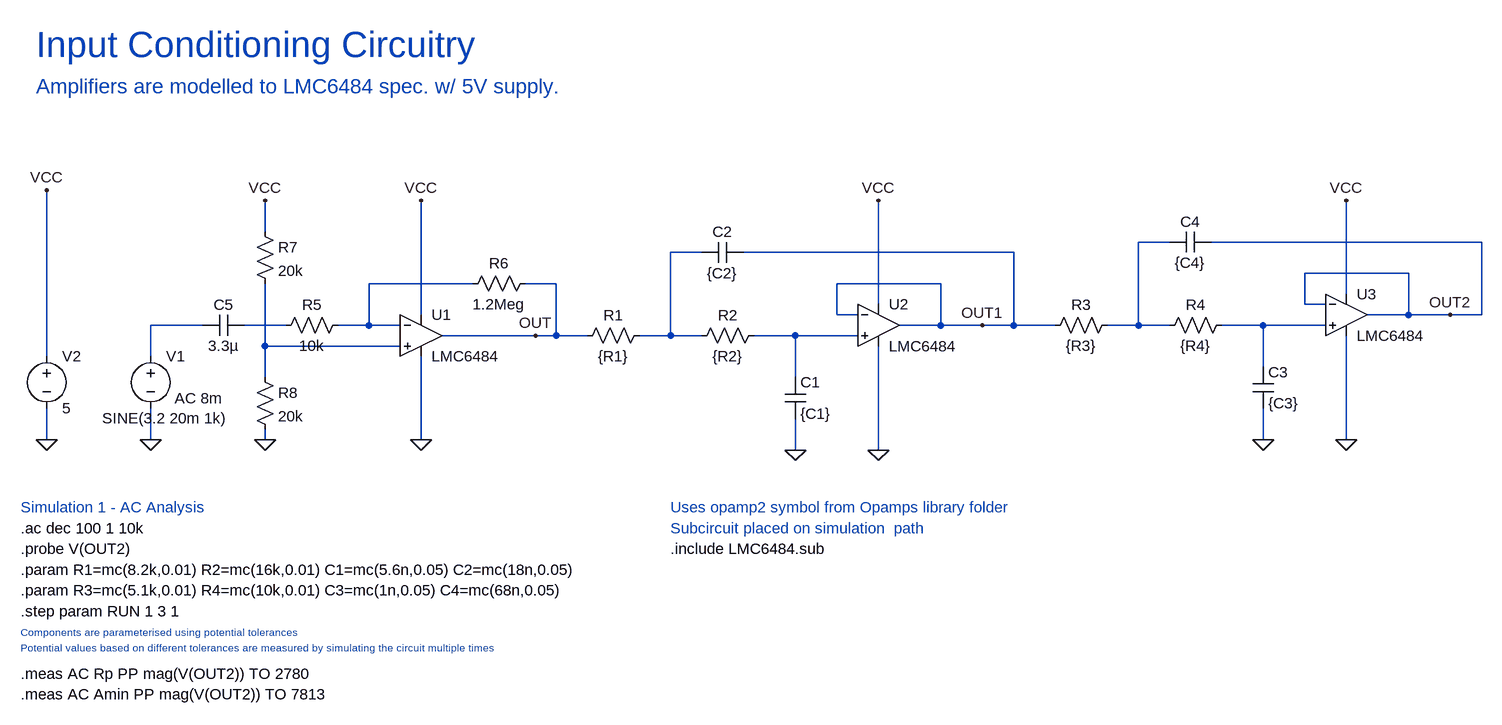
[diagram p0: schematic Final.asc]
Final.asc, the LTspice schematic file:
Version 4
SHEET 1 2964 920
WIRE 688 144 688 96
WIRE 2080 160 2032 160
WIRE 2560 160 2144 160
WIRE 1360 176 1312 176
WIRE 1840 176 1424 176
WIRE 2448 208 2288 208
WIRE 1008 224 848 224
WIRE 1136 224 1088 224
WIRE 1728 224 1568 224
WIRE 2352 240 2352 96
WIRE 1632 256 1632 96
WIRE 2288 256 2288 208
WIRE 2320 256 2288 256
WIRE 928 272 928 96
WIRE 1568 272 1568 224
WIRE 1600 272 1568 272
WIRE 2448 272 2448 208
WIRE 2448 272 2384 272
WIRE 2512 272 2448 272
WIRE 2560 272 2560 160
WIRE 2560 272 2512 272
WIRE 592 288 512 288
WIRE 720 288 656 288
WIRE 848 288 848 224
WIRE 848 288 800 288
WIRE 896 288 848 288
WIRE 1728 288 1728 224
WIRE 1728 288 1664 288
WIRE 1792 288 1728 288
WIRE 1840 288 1840 176
WIRE 1840 288 1792 288
WIRE 1904 288 1840 288
WIRE 2032 288 2032 160
WIRE 2032 288 1984 288
WIRE 2080 288 2032 288
WIRE 2224 288 2160 288
WIRE 2320 288 2224 288
WIRE 1104 304 960 304
WIRE 1136 304 1136 224
WIRE 1136 304 1104 304
WIRE 1184 304 1136 304
WIRE 1312 304 1312 176
WIRE 1312 304 1264 304
WIRE 1360 304 1312 304
WIRE 1504 304 1440 304
WIRE 1600 304 1504 304
WIRE 688 320 688 224
WIRE 896 320 688 320
WIRE 352 336 352 80
WIRE 512 336 512 288
WIRE 2224 352 2224 288
WIRE 688 368 688 320
WIRE 1504 368 1504 304
WIRE 352 464 352 416
WIRE 512 464 512 416
WIRE 688 464 688 448
WIRE 928 464 928 336
WIRE 2224 464 2224 416
WIRE 2352 464 2352 304
WIRE 1504 480 1504 432
WIRE 1632 480 1632 320
FLAG 928 464 0
FLAG 512 464 0
FLAG 1104 304 OUT
FLAG 688 464 0
FLAG 1632 480 0
FLAG 352 464 0
FLAG 1504 480 0
FLAG 1792 288 OUT1
FLAG 2352 464 0
FLAG 2224 464 0
FLAG 2512 272 OUT2
FLAG 1632 96 VCC
FLAG 2352 96 VCC
FLAG 352 80 VCC
FLAG 688 96 VCC
FLAG 928 96 VCC
SYMBOL Opamps\\opamp2 928 240 R0
SYMATTR InstName U1
SYMATTR Value LMC6484
SYMBOL res 816 272 R90
WINDOW 0 0 56 VBottom 2
WINDOW 3 32 56 VTop 2
SYMATTR InstName R5
SYMATTR Value 10k
SYMBOL res 1104 208 R90
WINDOW 0 0 56 VBottom 2
WINDOW 3 32 56 VTop 2
SYMATTR InstName R6
SYMATTR Value 1.2Meg
SYMBOL voltage 512 320 R0
WINDOW 3 -75 111 Left 2
WINDOW 123 37 80 Left 2
WINDOW 39 0 0 Left 2
SYMATTR Value SINE(3.2 20m 1k)
SYMATTR Value2 AC 8m
SYMATTR InstName V1
SYMBOL cap 656 272 R90
WINDOW 0 0 32 VBottom 2
WINDOW 3 32 32 VTop 2
SYMATTR InstName C5
SYMATTR Value 3.3µ
SYMBOL res 672 128 R0
SYMATTR InstName R7
SYMATTR Value 20k
SYMBOL res 672 352 R0
SYMATTR InstName R8
SYMATTR Value 20k
SYMBOL Opamps\\opamp2 1632 224 R0
SYMATTR InstName U2
SYMATTR Value LMC6484
SYMBOL voltage 352 320 R0
SYMATTR InstName V2
SYMATTR Value 5
SYMBOL res 1280 288 R90
WINDOW 0 0 56 VBottom 2
WINDOW 3 32 56 VTop 2
SYMATTR InstName R1
SYMATTR Value {R1}
SYMBOL res 1456 288 R90
WINDOW 0 0 56 VBottom 2
WINDOW 3 32 56 VTop 2
SYMATTR InstName R2
SYMATTR Value {R2}
SYMBOL cap 1488 368 R0
SYMATTR InstName C1
SYMATTR Value {C1}
SYMBOL cap 1424 160 R90
WINDOW 0 0 32 VBottom 2
WINDOW 3 32 32 VTop 2
SYMATTR InstName C2
SYMATTR Value {C2}
SYMBOL Opamps\\opamp2 2352 208 R0
SYMATTR InstName U3
SYMATTR Value LMC6484
SYMBOL res 2000 272 R90
WINDOW 0 0 56 VBottom 2
WINDOW 3 32 56 VTop 2
SYMATTR InstName R3
SYMATTR Value {R3}
SYMBOL res 2176 272 R90
WINDOW 0 0 56 VBottom 2
WINDOW 3 32 56 VTop 2
SYMATTR InstName R4
SYMATTR Value {R4}
SYMBOL cap 2208 352 R0
SYMATTR InstName C3
SYMATTR Value {C3}
SYMBOL cap 2144 144 R90
WINDOW 0 0 32 VBottom 2
WINDOW 3 32 32 VTop 2
SYMATTR InstName C4
SYMATTR Value {C4}
TEXT 336 -144 Left 5 ;Input Conditioning Circuitry
TEXT 336 -80 Left 3 ;Amplifiers are modelled to LMC6484 spec. w/ 5V supply.
TEXT 1312 632 Left 2 !.include LMC6484.sub
TEXT 312 824 Left 2 !.meas AC Rp PP mag(V(OUT2)) TO 2780
TEXT 312 856 Left 2 !.meas AC Amin PP mag(V(OUT2)) TO 7813
TEXT 312 696 Left 2 !.param R3=mc(5.1k,0.01) R4=mc(10k,0.01) C3=mc(1n,0.05) C4=mc(68n,0.05)
TEXT 312 664 Left 2 !.param R1=mc(8.2k,0.01) R2=mc(16k,0.01) C1=mc(5.6n,0.05) C2=mc(18n,0.05)
TEXT 1312 568 Left 2 ;Uses opamp2 symbol from Opamps library folder
TEXT 1312 600 Left 2 ;Subcircuit placed on simulation  path
TEXT 312 568 Left 2 ;Simulation 1 - AC Analysis
TEXT 312 760 Left 1 ;Components are parameterised using potential tolerances
TEXT 312 784 Left 1 ;Potential values based on different tolerances are measured by simulating the circuit multiple times
TEXT 312 600 Left 2 !.ac dec 100 1 10k
TEXT 312 632 Left 2 !.probe V(OUT2)
TEXT 312 728 Left 2 !.step param RUN 1 3 1

The netlist it stands for:
* Final.asc
XU1 N008 N003 VCC 0 OUT LMC6484  ; pins In+ In- V+ V- OUT
R5 N003 N005 10k
R6 OUT N003 1.2Meg
V1 N004 0 SINE(3.2 20m 1k) AC 8m
C5 N005 N004 3.3µ
R7 VCC N008 20k
R8 N008 0 20k
XU2 N007 OUT1 VCC 0 OUT1 LMC6484  ; pins In+ In- V+ V- OUT
V2 VCC 0 5
R1 N002 OUT {R1}
R2 N007 N002 {R2}
C1 N007 0 {C1}
C2 OUT1 N002 {C2}
XU3 N006 OUT2 VCC 0 OUT2 LMC6484  ; pins In+ In- V+ V- OUT
R3 N001 OUT1 {R3}
R4 N006 N001 {R4}
C3 N006 0 {C3}
C4 OUT2 N001 {C4}
* Input Conditioning Circuitry
* Amplifiers are modelled to LMC6484 spec. w/ 5V supply.
.include LMC6484.sub
.meas AC Rp PP mag(V(OUT2)) TO 2780
.meas AC Amin PP mag(V(OUT2)) TO 7813
.param R3=mc(5.1k,0.01) R4=mc(10k,0.01) C3=mc(1n,0.05) C4=mc(68n,0.05)
.param R1=mc(8.2k,0.01) R2=mc(16k,0.01) C1=mc(5.6n,0.05) C2=mc(18n,0.05)
* Uses opamp2 symbol from Opamps library folder
* Subcircuit placed on simulation  path
* Simulation 1 - AC Analysis
* Components are parameterised using potential tolerances
* Potential values based on different tolerances are measured by simulating the circuit multiple times
.ac dec 100 1 10k
.probe V(OUT2)
.step param RUN 1 3 1
.backanno
.end